# Altium schematic sheet resistors.SchDoc
size 381 x 241 mm; SheetNumber: 12; SheetTotal: 12
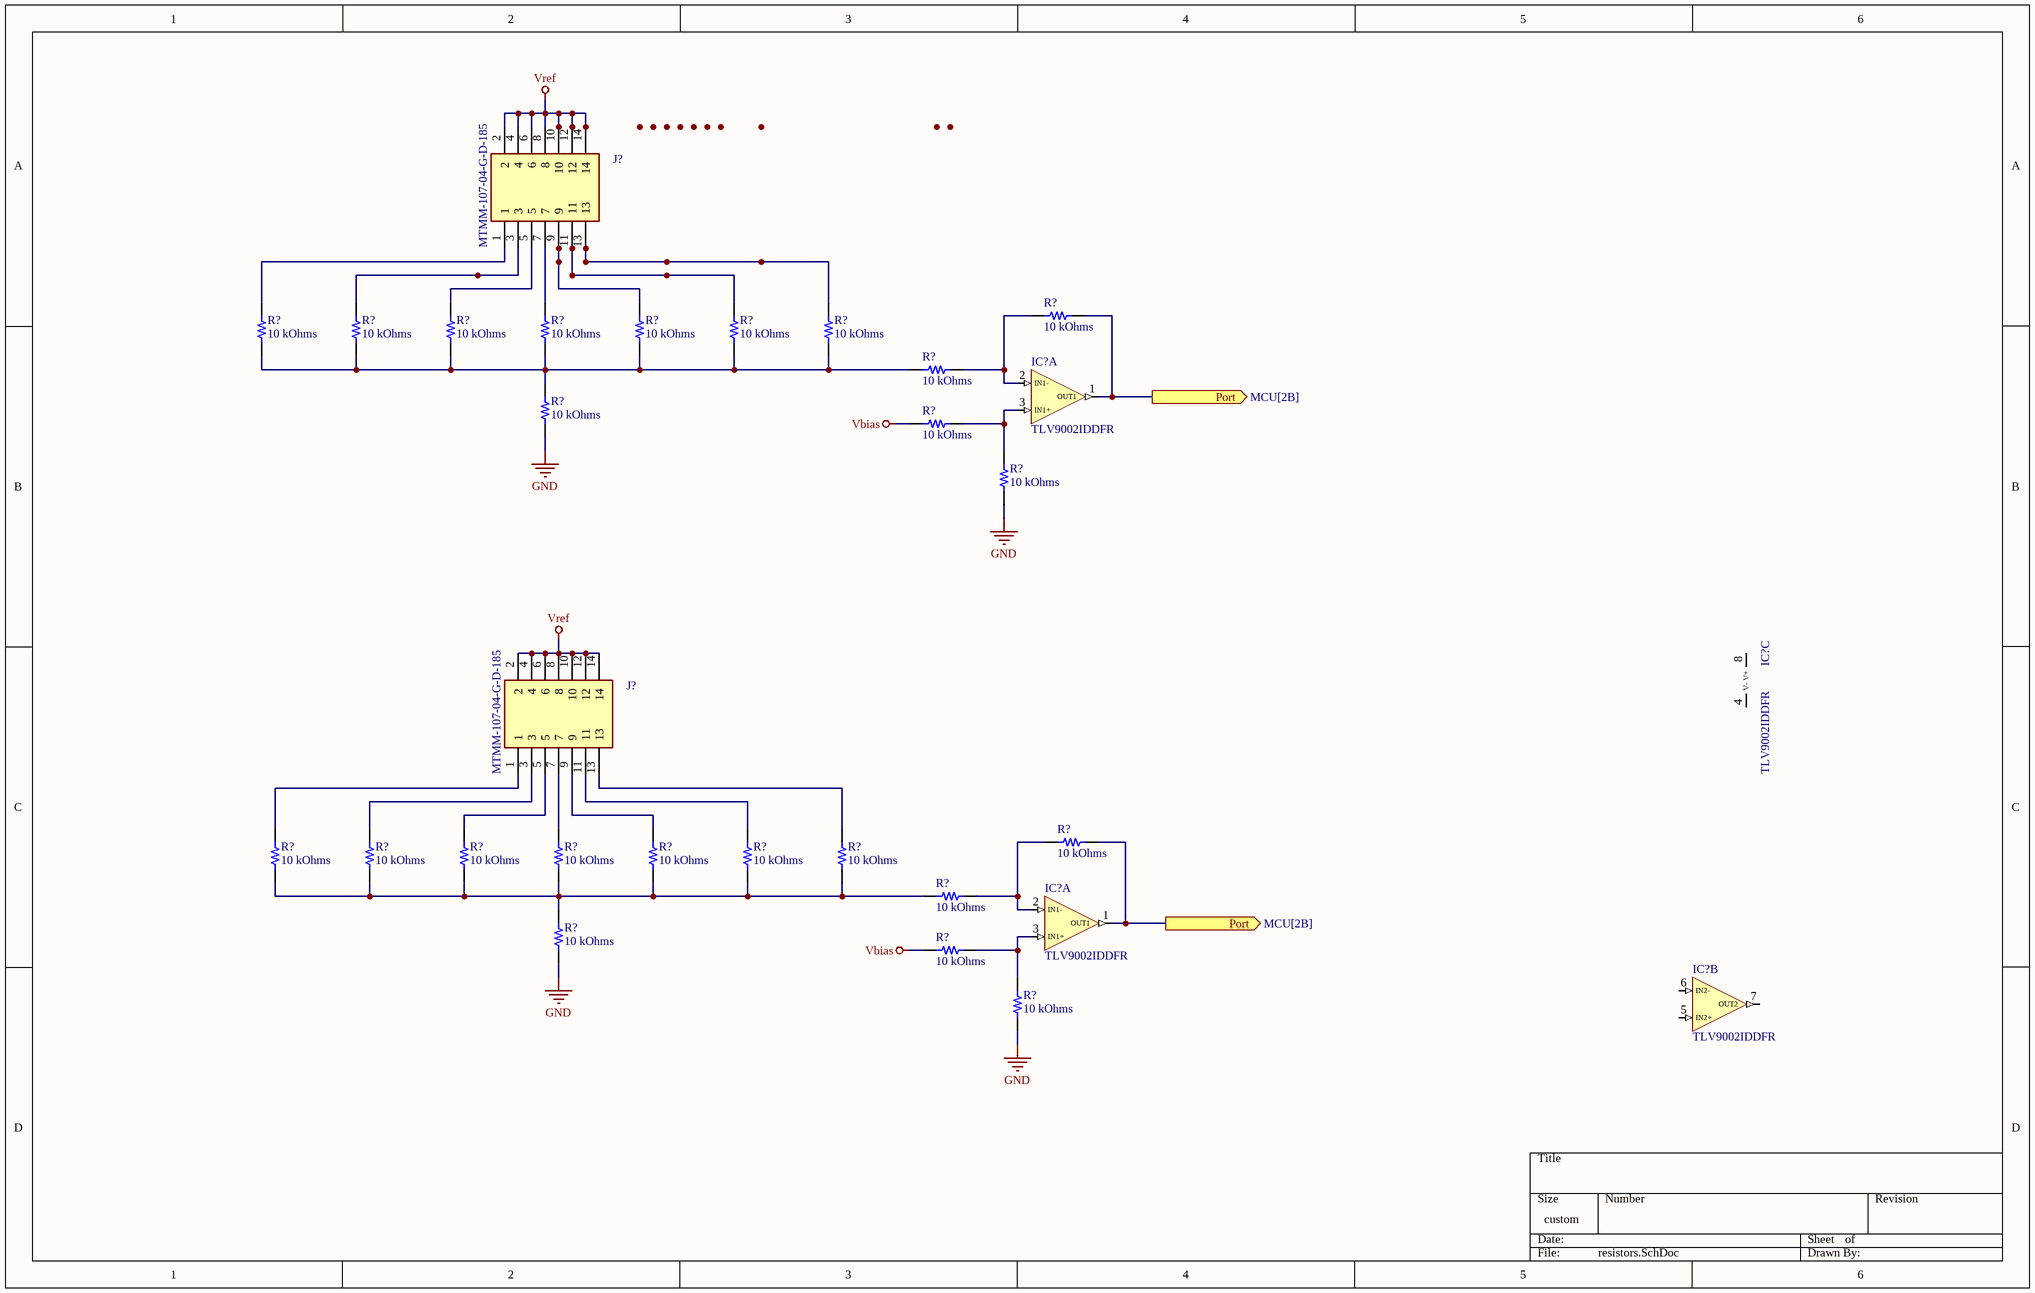
[diagram p0: resistors.SchDoc]

## Parts
(Parts that share a designator on the sheet are numbered #1, #2 ... from top to bottom, then left to right.)
IC?#1  TLV9002IDDFR  [SOT65P280X110-8N]  (part A of 3)
IC?#2  TLV9002IDDFR  [SOT65P280X110-8N]  (part C of 3)
IC?#3  TLV9002IDDFR  [SOT65P280X110-8N]  (part A of 3)
IC?#4  TLV9002IDDFR  [SOT65P280X110-8N]  (part B of 3)
J?#1  MTMM-107-04-G-D-185  [MTMM10704GD185]
J?#2  MTMM-107-04-G-D-185  [MTMM10704GD185]
R?#1  10 kOhms  [YAGEO RES 1206_3216]
R?#2  10 kOhms  [YAGEO RES 1206_3216]
R?#3  10 kOhms  [YAGEO RES 1206_3216]
R?#4  10 kOhms  [YAGEO RES 1206_3216]
R?#5  10 kOhms  [YAGEO RES 1206_3216]
R?#6  10 kOhms  [YAGEO RES 1206_3216]
R?#7  10 kOhms  [YAGEO RES 1206_3216]
R?#8  10 kOhms  [YAGEO RES 1206_3216]
R?#9  10 kOhms  [YAGEO RES 1206_3216]
R?#10  10 kOhms  [YAGEO RES 1206_3216]
R?#11  10 kOhms  [YAGEO RES 1206_3216]
R?#12  10 kOhms  [YAGEO RES 1206_3216]
R?#13  10 kOhms  [YAGEO RES 1206_3216]
R?#14  10 kOhms  [YAGEO RES 1206_3216]
R?#15  10 kOhms  [YAGEO RES 1206_3216]
R?#16  10 kOhms  [YAGEO RES 1206_3216]
R?#17  10 kOhms  [YAGEO RES 1206_3216]
R?#18  10 kOhms  [YAGEO RES 1206_3216]
R?#19  10 kOhms  [YAGEO RES 1206_3216]
R?#20  10 kOhms  [YAGEO RES 1206_3216]
R?#21  10 kOhms  [YAGEO RES 1206_3216]
R?#22  10 kOhms  [YAGEO RES 1206_3216]
R?#23  10 kOhms  [YAGEO RES 1206_3216]
R?#24  10 kOhms  [YAGEO RES 1206_3216]

## Ports
Port (out, see MCU[2B])

## Nets
GND: R?#10.1 R?#12.1 R?#22.1 R?#24.1
Vbias: R?#11.2 R?#23.2
Vref: J?#1.2 J?#1.4 J?#1.6 J?#1.8 J?#1.10 J?#1.12 J?#1.14 J?#2.2 J?#2.4 J?#2.6 J?#2.8 J?#2.10 J?#2.12 J?#2.14
Port: IC?#1.1(OUT1) IC?#3.1(OUT1) R?#1.1 R?#13.1 ; port Port
NetIC?#1_2: IC?#1.2(IN1-) R?#1.2 R?#9.1
NetIC?#1_3: IC?#1.3(IN1+) R?#11.1 R?#12.2
NetIC?#3_2: IC?#3.2(IN1-) R?#13.2 R?#21.1
NetIC?#3_3: IC?#3.3(IN1+) R?#23.1 R?#24.2
NetJ?#1_1: J?#1.1 R?#2.2
NetJ?#1_3: J?#1.3 R?#3.2
NetJ?#1_5: J?#1.5 R?#4.2
NetJ?#1_7: J?#1.7 R?#5.2
NetJ?#1_9: J?#1.9 R?#6.2
NetJ?#1_11: J?#1.11 R?#7.2
NetJ?#1_13: J?#1.13 R?#8.2
NetJ?#2_1: J?#2.1 R?#14.2
NetJ?#2_3: J?#2.3 R?#15.2
NetJ?#2_5: J?#2.5 R?#16.2
NetJ?#2_7: J?#2.7 R?#17.2
NetJ?#2_9: J?#2.9 R?#18.2
NetJ?#2_11: J?#2.11 R?#19.2
NetJ?#2_13: J?#2.13 R?#20.2
NetR?#2_1: R?#2.1 R?#3.1 R?#4.1 R?#5.1 R?#6.1 R?#7.1 R?#8.1 R?#9.2 R?#10.2
NetR?#14_1: R?#14.1 R?#15.1 R?#16.1 R?#17.1 R?#18.1 R?#19.1 R?#20.1 R?#21.2 R?#22.2

Not connected (* = marked no-connect by the designer): IC?#2 4(V-) 8(V+); IC?#4 5(IN2+) 6(IN2-) 7(OUT2)

## Library data of the parts
IC?#1-IC?#4 = TLV9002IDDFR: Integrated Circuit; Manufacturer_Name: Texas Instruments; Datasheet Link: https://www.ti.com/lit/gpn/TLV9002; Height: 1.1mm; Manufacturer_Part_Number: TLV9002IDDFR; Mouser Part Number: 595-TLV9002IDDFR; Mouser Price/Stock: https://www.mouser.co.uk/ProductDetail/Texas-Instruments/TLV9002IDDFR?qs=mAH9sUMRCtuVJ6NmNV%252Bgrw%3D%3D; Arrow Part Number: TLV9002IDDFR; Arrow Price/Stock: https://www.arrow.com/en/products/tlv9002iddfr/texas-instruments?utm_currency=USD&region=nac
J?#1 J?#2 = MTMM-107-04-G-D-185: Connector; Manufacturer_Name: SAMTEC; Datasheet Link: https://suddendocs.samtec.com/prints/mtmm-1xx-xx-xx-x-xxx-xx-xxx-mkt.pdf?_gl=1*gklr36*_gcl_aw*R0NMLjE3NDEzMjczNDIuQ2p3S0NBaUFyS1ctQmhBekVpd0FaaFdzSU81NXRXcmh5VS16b3pEZ1BfdFZablZIZUl1bFk4SG5uQlVzb0JsazkxbHVlaFo1OVhKaGZCb0N5SGtRQXZEX0J3RQ..*_gcl_au*OTA0NjU5; Height: 8.333mm; Manufacturer_Part_Number: MTMM-107-04-G-D-185; Mouser Part Number: 200-MTMM10704GD185; Mouser Price/Stock: https://www.mouser.co.uk/ProductDetail/Samtec/MTMM-107-04-G-D-185?qs=DJA8%252BIqD56WvW%2Fj12n4w4g%3D%3D
R?#1-R?#24 = RT1206FRE0710KL: RES SMD 10K OHM 1% 1/4W 1206; Manufacturer: Yageo; Power (Watts): 0.25W, 1/4W; Temperature Coefficient: ±50ppm/°C; Part Number: RT1206FRE0710KL; ComponentLink1Description: Datasheet; ComponentLink1URL: https://www.yageo.com/upload/media/product/productsearch/datasheet/rchip/PYu-RT_1-to-0.01_RoHS_L_11.pdf; ComponentLink2Description: DigiKey Link; ComponentLink2URL: https://www.digikey.com/en/products/detail/yageo/RT1206FRE0710KL/1082868; Composition: Thin Film; Device Package: 1206 (3216 Metric); Height - Seated (Max): 0.026" (0.65mm); LastUpdated: 7/25/2024 09:21:28; Lifecycle Status: Active; Minimum Order: 1; Number of Terminations: 2; Operating Temperature: -55°C ~ 155°C; Package / Case: 1206 (3216 Metric); Packaging: TapeAndReel; PartId: 38903; Part Status: Active; Price: 0.01; Resistance: 10 kOhms; Series: RT; Size / Dimension: 0.122" L x 0.063" W (3.10mm x 1.60mm); Supplier 1: DigiKey; Supplier Part Number 1: YAG1242CT-ND; Supplier Device Package: 1206; Tolerance: ±1%; Value: 10 kOhms